# EAGLE schematic LCD-OLINUXINO-7TS_Rev_D (EAGLE 4.16)
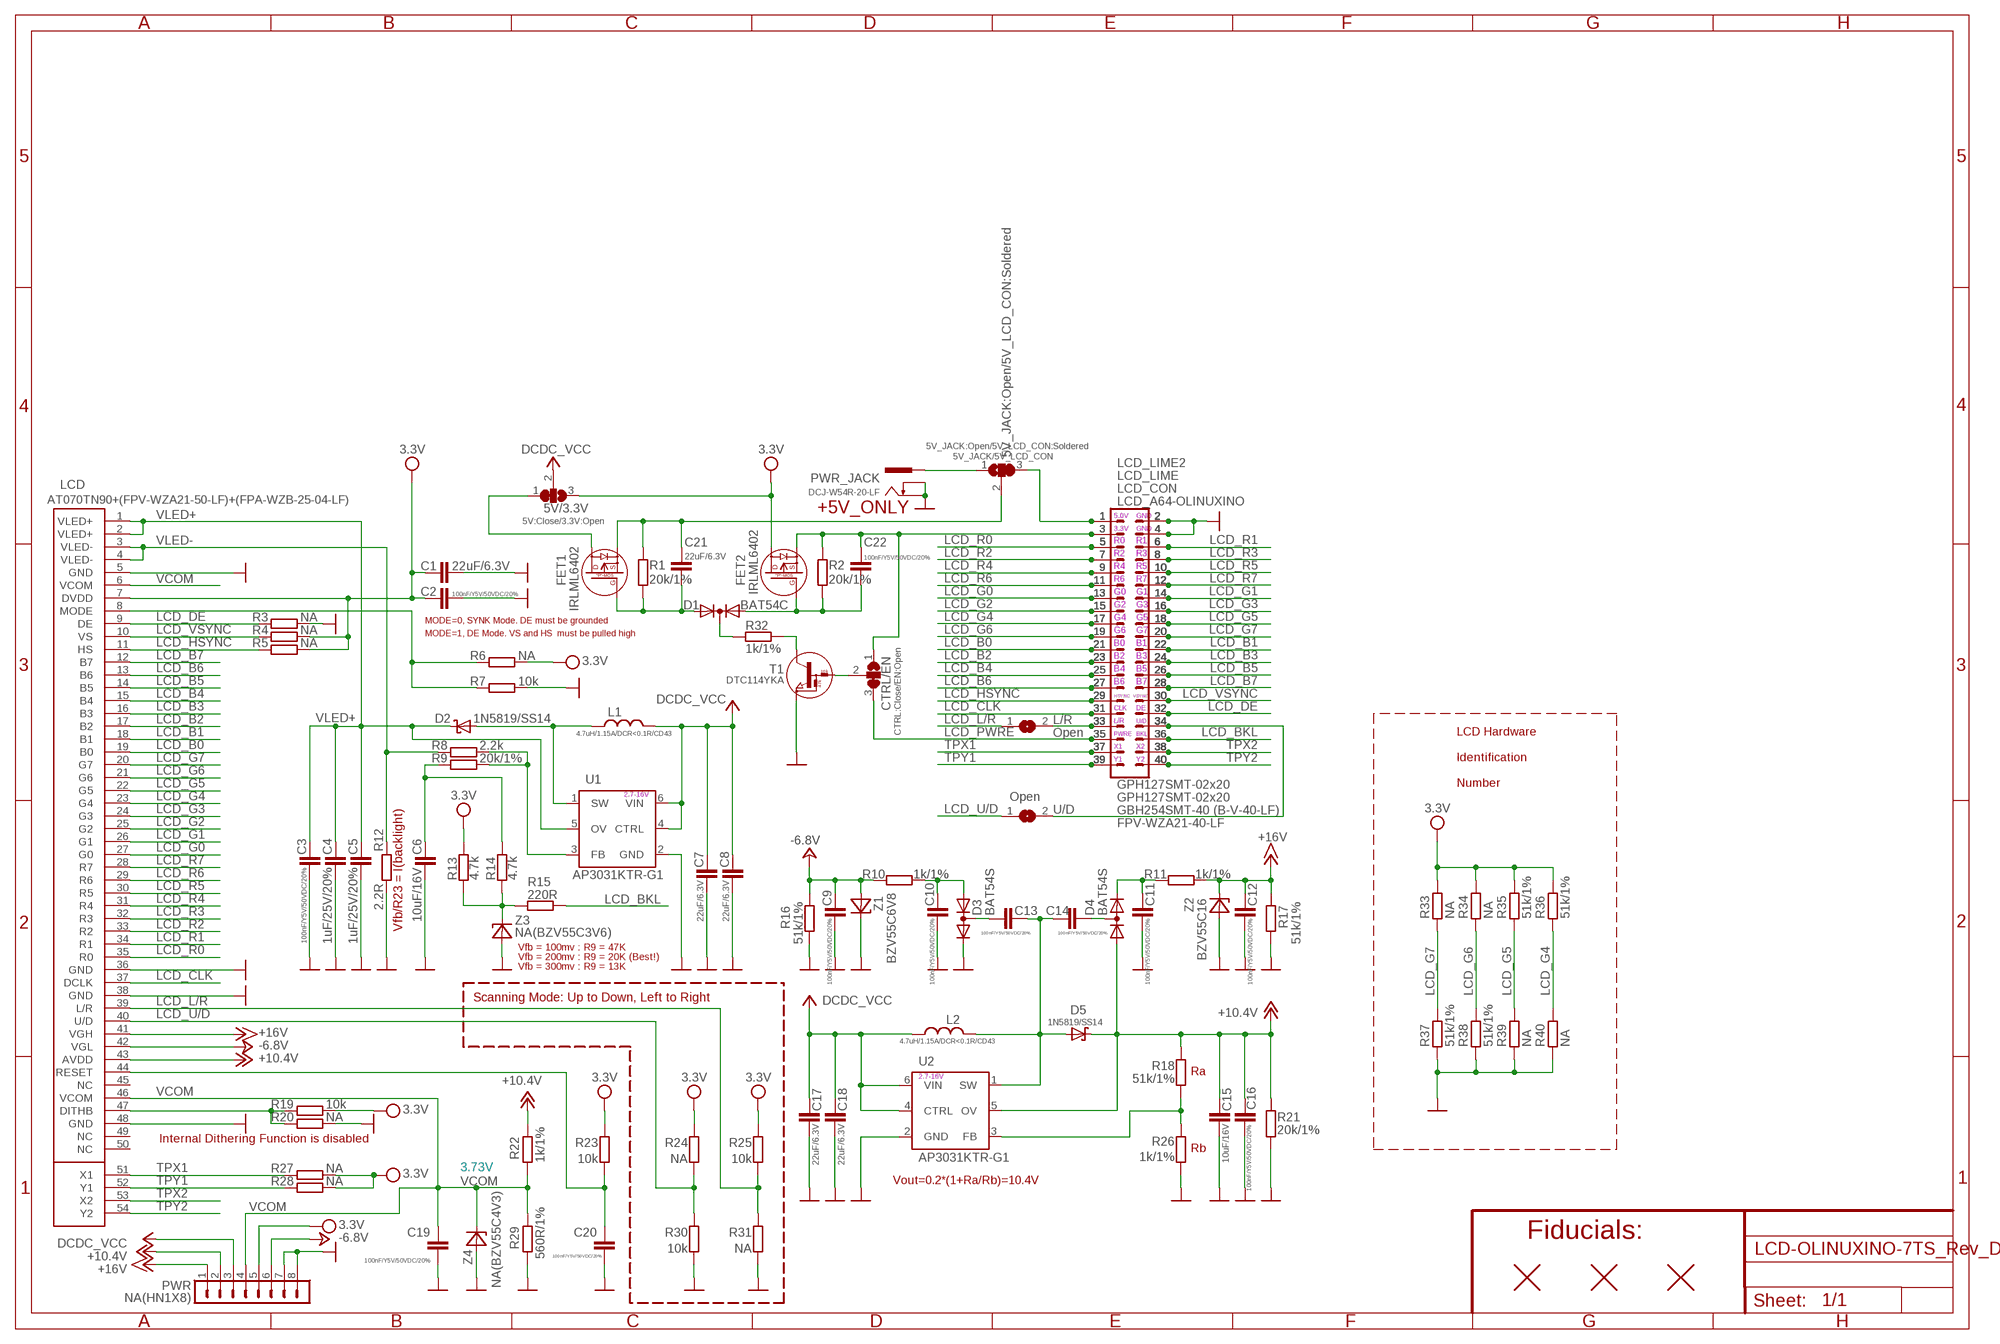
[diagram p0: schematic, sheet 1]

## Parts
5V/3.3V  5V:Close/3.3V:Open  SJ2W6  [SJ_2_SMALL_12_TIED]
5V_JACK/5V_LCD_CON  5V_JACK:Open/5V_LCD_CON:Soldered  SJ2W3  [SJ_2_SMALL]
C1  22uF/6.3V  C-EUC0603_DWS  [C0603_DWS]
C2  100nF/Y5V/50VDC/20%  C-EUC0603_DWS  [C0603_DWS]
C3  100nF/Y5V/50VDC/20%  C-EUC0603_DWS  [C0603_DWS]
C4  1uF/25V/20%  C-EUC0805_5MIL_DWS  [C0805_5MIL_DWS]
C5  1uF/25V/20%  C-EUC0805_5MIL_DWS  [C0805_5MIL_DWS]
C6  10uF/16V  C-EUC0805_5MIL_DWS  [C0805_5MIL_DWS]
C7  22uF/6.3V  C-EUC0603_DWS  [C0603_DWS]
C8  22uF/6.3V  C-EUC0603_DWS  [C0603_DWS]
C9  100nF/Y5V/50VDC/20%  C-EUC0603_DWS  [C0603_DWS]
C10  100nF/Y5V/50VDC/20%  C-EUC0603_DWS  [C0603_DWS]
C11  100nF/Y5V/50VDC/20%  C-EUC0603_DWS  [C0603_DWS]
C12  100nF/Y5V/50VDC/20%  C-EUC0603_DWS  [C0603_DWS]
C13  100nF/Y5V/50VDC/20%  C-EUC0603_DWS  [C0603_DWS]
C14  100nF/Y5V/50VDC/20%  C-EUC0603_DWS  [C0603_DWS]
C15  10uF/16V  C-EUC0805_5MIL_DWS  [C0805_5MIL_DWS]
C16  100nF/Y5V/50VDC/20%  C-EUC0603_DWS  [C0603_DWS]
C17  22uF/6.3V  C-EUC0603_DWS  [C0603_DWS]
C18  22uF/6.3V  C-EUC0603_DWS  [C0603_DWS]
C19  100nF/Y5V/50VDC/20%  C-EUC0603_DWS  [C0603_DWS]
C20  100nF/Y5V/50VDC/20%  C-EUC0603_DWS  [C0603_DWS]
C21  22uF/6.3V  C-EUC0603_DWS  [C0603_DWS]
C22  100nF/Y5V/50VDC/20%  C-EUC0603_DWS  [C0603_DWS]
CTRL/EN  CTRL:Close/EN:Open  SJ2W5  [SJ_2_SMALL_23_TIED]
D1  BAT54C  DIODE_AC-CA_  [SOT23C]
D2  1N5819/SS14  SCHOTKKY7.62SS2  [MLL-41]
D3  BAT54S  DIODE_AC-AC_  [SOT23C(BAT54S)]
D4  BAT54S  DIODE_AC-AC_  [SOT23C(BAT54S)]
D5  1N5819/SS14  SCHOTKKY7.62SS2  [MLL-41]
FET1  IRLML6402  P-MOS+DIODIRLML6402  [SOT23]
FET2  IRLML6402  P-MOS+DIODIRLML6402  [SOT23]
L1  4.7uH/1.15A/DCR<0.1R/CD43  L-CD42(43)  [CD42(43)]
L2  4.7uH/1.15A/DCR<0.1R/CD43  L-CD42(43)  [CD42(43)]
L/R  Open  SJSJ_SMALLER  [SJ_1_SMALLER]
LCD  AT070TN90+(FPV-WZA21-50-LF)+(FPA-WZB-25-04-LF)  LCD7"_TOUCH  [LCD7"_TOUCH(AT070TN90)]
LCD_A64-OLINUXINO  FPV-WZA21-40-LF  ML40-FPV-WZA21-40-LF  [FPV-WZA21-40-LF]
LCD_CON  GBH254SMT-40 (B-V-40-LF)  ML40-GBH-254-SMT-40_TEST  [ML40-MALE(GBH-254-SMT-40)_TEST]
LCD_LIME  GPH127SMT-02x20  ML40YA-V36P-2X20-LF_0.90_DRILL  [YA-V36P-2X20-LF_0.9DRILL]
LCD_LIME2  GPH127SMT-02x20  ML40PA-V16X-2X20-LF_0.90_DRILL  [GPH127SMT-02X20(PA-V16X-2X20-LF)_DRILL_0.9MM]
PWR  NA(HN1X8)  CON8HN1X8  [HN1X8]
PWR_JACK  DCJ-W54R-20-LF  PWR-JAKDCJ-W  [PWR-JACK-SMD]
R1  20k/1%  R-EU_R0603_5MIL_DWS  [R0603_5MIL_DWS]
R2  20k/1%  R-EU_R0603_5MIL_DWS  [R0603_5MIL_DWS]
R3  NA  R-EU_R0603_5MIL_DWS  [R0603_5MIL_DWS]
R4  NA  R-EU_R0603_5MIL_DWS  [R0603_5MIL_DWS]
R5  NA  R-EU_R0603_5MIL_DWS  [R0603_5MIL_DWS]
R6  NA  R-EU_R0603_5MIL_DWS  [R0603_5MIL_DWS]
R7  10k  R-EU_R0603_5MIL_DWS  [R0603_5MIL_DWS]
R8  2.2k  R-EU_R0603_5MIL_DWS  [R0603_5MIL_DWS]
R9  20k/1%  R-EU_R0603_5MIL_DWS  [R0603_5MIL_DWS]
R10  1k/1%  R-EU_R0603_5MIL_DWS  [R0603_5MIL_DWS]
R11  1k/1%  R-EU_R0603_5MIL_DWS  [R0603_5MIL_DWS]
R12  2.2R  R-EU_R0603_5MIL_DWS  [R0603_5MIL_DWS]
R13  4.7k  R-EU_R0603_5MIL_DWS  [R0603_5MIL_DWS]
R14  4.7k  R-EU_R0603_5MIL_DWS  [R0603_5MIL_DWS]
R15  220R  R-EU_R0603_5MIL_DWS  [R0603_5MIL_DWS]
R16  51k/1%  R-EU_R0603_5MIL_DWS  [R0603_5MIL_DWS]
R17  51k/1%  R-EU_R0603_5MIL_DWS  [R0603_5MIL_DWS]
R18  51k/1%  R-EU_R0603_5MIL_DWS  [R0603_5MIL_DWS]
R19  10k  R-EU_R0603_5MIL_DWS  [R0603_5MIL_DWS]
R20  NA  R-EU_R0603_5MIL_DWS  [R0603_5MIL_DWS]
R21  20k/1%  R-EU_R0603_5MIL_DWS  [R0603_5MIL_DWS]
R22  1k/1%  R-EU_R0603_5MIL_DWS  [R0603_5MIL_DWS]
R23  10k  R-EU_R0603_5MIL_DWS  [R0603_5MIL_DWS]
R24  NA  R-EU_R0603_5MIL_DWS  [R0603_5MIL_DWS]
R25  10k  R-EU_R0603_5MIL_DWS  [R0603_5MIL_DWS]
R26  1k/1%  R-EU_R0603_5MIL_DWS  [R0603_5MIL_DWS]
R27  NA  R-EU_R0603_5MIL_DWS  [R0603_5MIL_DWS]
R28  NA  R-EU_R0603_5MIL_DWS  [R0603_5MIL_DWS]
R29  560R/1%  R-EU_R0603_5MIL_DWS  [R0603_5MIL_DWS]
R30  10k  R-EU_R0603_5MIL_DWS  [R0603_5MIL_DWS]
R31  NA  R-EU_R0603_5MIL_DWS  [R0603_5MIL_DWS]
R32  1k/1%  R-EU_R0603_5MIL_DWS  [R0603_5MIL_DWS]
R33  NA  R-EU_R0603_5MIL_DWS  [R0603_5MIL_DWS]
R34  NA  R-EU_R0603_5MIL_DWS  [R0603_5MIL_DWS]
R35  51k/1%  R-EU_R0603_5MIL_DWS  [R0603_5MIL_DWS]
R36  51k/1%  R-EU_R0603_5MIL_DWS  [R0603_5MIL_DWS]
R37  51k/1%  R-EU_R0603_5MIL_DWS  [R0603_5MIL_DWS]
R38  51k/1%  R-EU_R0603_5MIL_DWS  [R0603_5MIL_DWS]
R39  NA  R-EU_R0603_5MIL_DWS  [R0603_5MIL_DWS]
R40  NA  R-EU_R0603_5MIL_DWS  [R0603_5MIL_DWS]
T1  DTC114YKA  DIGITAL_TRANSISTORS-NPNDTC114YKA  [SOT-23]
U1  AP3031KTR-G1  [SOT23-6]
U2  AP3031KTR-G1  [SOT23-6]
U$1  FIDUCIAL  [FIDUCIAL-1X3]
U$2  FIDUCIAL  [FIDUCIAL-1X3]
U$3  FIDUCIAL  [FIDUCIAL-1X3]
U/D  Open  SJSJ_SMALLER  [SJ_1_SMALLER]
Z1  BZV55C6V8  ZDIOD-SMD  [MINI-MELF]
Z2  BZV55C16  ZDIOD-SMD  [MINI-MELF]
Z3  NA(BZV55C3V6)  ZDIOD-SMD  [MINI-MELF]
Z4  NA(BZV55C4V3)  ZDIOD-SMD  [MINI-MELF]

## Nets
+5V: 5V/3.3V.2 C7.2 C8.2 C17.2 C18.2 L1.1 L2.1 PWR.3 U1.4(CTRL) U1.6(VIN) U2.4(CTRL) U2.6(VIN) ; supply symbol labelled DCDC_VCC
+12V: C15.1 C16.1 D4.1(A) D5.K(C) LCD.43(AVDD) PWR.2 R18.2 R21.2 R22.1 U2.5(OV) ; supply symbol labelled +10.4V
+15V: C12.1 LCD.41(VGH) PWR.1 R11.1 R17.2 Z2.1(C) ; supply symbol labelled +16V
-24V: C9.1 LCD.42(VGL) PWR.6 R10.1 R16.2 Z1.2(A) ; supply symbol labelled -6.8V
GND [pwr]: C1.2 C2.2 C3.2 C4.2 C5.2 C6.2 C7.1 C8.1 C9.2 C10.2 C11.2 C12.2 C15.2 C16.2 C17.1 C18.1 C19.2 C20.2 D3.2(K) LCD.5(GND) LCD.36(GND) LCD.38(GND) LCD.48(GND) LCD_A64-OLINUXINO.2 LCD_A64-OLINUXINO.4 LCD_CON.2 LCD_CON.4 LCD_LIME2.2 LCD_LIME2.4 LCD_LIME.2 LCD_LIME.4 PWR.7 PWR.8 PWR_JACK.2(-) PWR_JACK.3(--) R3.1 R7.1 R12.2 R16.1 R17.1 R20.1 R21.1 R26.2 R29.2 R30.2 R31.2 R37.1 R38.1 R39.1 R40.1 T1.2(E) U1.2(GND) U2.2(GND) Z1.1(C) Z2.2(A) Z3.2(A) Z4.2(A)
LCD_B0: LCD.19(B0) LCD_A64-OLINUXINO.21 LCD_CON.21 LCD_LIME2.21 LCD_LIME.21
LCD_B1: LCD.18(B1) LCD_A64-OLINUXINO.22 LCD_CON.22 LCD_LIME2.22 LCD_LIME.22
LCD_B2: LCD.17(B2) LCD_A64-OLINUXINO.23 LCD_CON.23 LCD_LIME2.23 LCD_LIME.23
LCD_B3: LCD.16(B3) LCD_A64-OLINUXINO.24 LCD_CON.24 LCD_LIME2.24 LCD_LIME.24
LCD_B4: LCD.15(B4) LCD_A64-OLINUXINO.25 LCD_CON.25 LCD_LIME2.25 LCD_LIME.25
LCD_B5: LCD.14(B5) LCD_A64-OLINUXINO.26 LCD_CON.26 LCD_LIME2.26 LCD_LIME.26
LCD_B6: LCD.13(B6) LCD_A64-OLINUXINO.27 LCD_CON.27 LCD_LIME2.27 LCD_LIME.27
LCD_B7: LCD.12(B7) LCD_A64-OLINUXINO.28 LCD_CON.28 LCD_LIME2.28 LCD_LIME.28
LCD_BKL: LCD_A64-OLINUXINO.36 LCD_CON.36 LCD_LIME2.36 LCD_LIME.36 R15.1
LCD_CLK: LCD.37(DCLK) LCD_A64-OLINUXINO.31 LCD_CON.31 LCD_LIME2.31 LCD_LIME.31
LCD_DE: LCD.9(DE) LCD_A64-OLINUXINO.32 LCD_CON.32 LCD_LIME2.32 LCD_LIME.32 R3.2
LCD_G0: LCD.27(G0) LCD_A64-OLINUXINO.13 LCD_CON.13 LCD_LIME2.13 LCD_LIME.13
LCD_G1: LCD.26(G1) LCD_A64-OLINUXINO.14 LCD_CON.14 LCD_LIME2.14 LCD_LIME.14
LCD_G2: LCD.25(G2) LCD_A64-OLINUXINO.15 LCD_CON.15 LCD_LIME2.15 LCD_LIME.15
LCD_G3: LCD.24(G3) LCD_A64-OLINUXINO.16 LCD_CON.16 LCD_LIME2.16 LCD_LIME.16
LCD_G4: LCD.23(G4) LCD_A64-OLINUXINO.17 LCD_CON.17 LCD_LIME2.17 LCD_LIME.17 R36.1 R40.2
LCD_G5: LCD.22(G5) LCD_A64-OLINUXINO.18 LCD_CON.18 LCD_LIME2.18 LCD_LIME.18 R35.1 R39.2
LCD_G6: LCD.21(G6) LCD_A64-OLINUXINO.19 LCD_CON.19 LCD_LIME2.19 LCD_LIME.19 R34.1 R38.2
LCD_G7: LCD.20(G7) LCD_A64-OLINUXINO.20 LCD_CON.20 LCD_LIME2.20 LCD_LIME.20 R33.1 R37.2
LCD_HSYNC: LCD.11(HS) LCD_A64-OLINUXINO.29 LCD_CON.29 LCD_LIME2.29 LCD_LIME.29 R5.2
LCD_L/R: L/R.1 LCD.39(L/R) R25.2 R31.1
LCD_PWRE: CTRL/EN.3 LCD_A64-OLINUXINO.35 LCD_CON.35 LCD_LIME2.35 LCD_LIME.35
LCD_R0: LCD.35(R0) LCD_A64-OLINUXINO.5 LCD_CON.5 LCD_LIME2.5 LCD_LIME.5
LCD_R1: LCD.34(R1) LCD_A64-OLINUXINO.6 LCD_CON.6 LCD_LIME2.6 LCD_LIME.6
LCD_R2: LCD.33(R2) LCD_A64-OLINUXINO.7 LCD_CON.7 LCD_LIME2.7 LCD_LIME.7
LCD_R3: LCD.32(R3) LCD_A64-OLINUXINO.8 LCD_CON.8 LCD_LIME2.8 LCD_LIME.8
LCD_R4: LCD.31(R4) LCD_A64-OLINUXINO.9 LCD_CON.9 LCD_LIME2.9 LCD_LIME.9
LCD_R5: LCD.30(R5) LCD_A64-OLINUXINO.10 LCD_CON.10 LCD_LIME2.10 LCD_LIME.10
LCD_R6: LCD.29(R6) LCD_A64-OLINUXINO.11 LCD_CON.11 LCD_LIME2.11 LCD_LIME.11
LCD_R7: LCD.28(R7) LCD_A64-OLINUXINO.12 LCD_CON.12 LCD_LIME2.12 LCD_LIME.12
LCD_U/D: LCD.40(U/D) R24.2 R30.1 U/D.1
LCD_VSYNC: LCD.10(VS) LCD_A64-OLINUXINO.30 LCD_CON.30 LCD_LIME2.30 LCD_LIME.30 R4.2
N$1: LCD.8(MODE) R6.2 R7.2
N$2: C14.2 D4.3(AK)
N$3 [pwr]: C22.1 CTRL/EN.1 FET2.2(S) LCD_A64-OLINUXINO.3 LCD_CON.3 LCD_LIME2.3 LCD_LIME.3 R2.2
N$4: C11.1 D4.2(K) R11.2
N$5: R8.1 R9.1 U1.3(FB)
N$6: C10.1 D3.1(A) R10.2
N$7: 5V_JACK/5V_LCD_CON.2 C21.1 FET1.2(S) R1.2
N$8: C22.2 D1.1(A1) FET2.1(G) R2.1
N$9: C21.2 D1.2(A2) FET1.1(G) R1.1
N$10: C13.1 D3.3(AK)
N$11: R32.1 T1.3(C)
N$12: C6.1 R9.2 R14.2
N$13: D2.A L1.2 U1.1(SW)
N$14: R13.1 R14.1 R15.2 Z3.1(C)
N$15: L/R.2 LCD_A64-OLINUXINO.33 LCD_CON.33 LCD_LIME2.33 LCD_LIME.33
N$16: CTRL/EN.2 T1.1(B)
N$17: LCD_A64-OLINUXINO.34 LCD_CON.34 LCD_LIME2.34 LCD_LIME.34 U/D.2
N$18: 5V/3.3V.1 FET1.3(D)
N$19: D1.3(K) R32.2
N$22: 5V_JACK/5V_LCD_CON.1 PWR_JACK.1(+)
N$23: 5V_JACK/5V_LCD_CON.3 LCD_A64-OLINUXINO.1 LCD_CON.1 LCD_LIME2.1 LCD_LIME.1
N$42: LCD.47(DITHB) R19.2 R20.2
N$123: C13.2 C14.1 D5.A L2.2 U2.1(SW)
N$126: R18.1 R26.1 U2.3(FB)
RESET: C20.1 LCD.44(RESET) R23.2
TPX1: LCD.51(X1) LCD_A64-OLINUXINO.37 LCD_CON.37 LCD_LIME2.37 LCD_LIME.37 R27.2
TPX2: LCD.53(X2) LCD_A64-OLINUXINO.38 LCD_CON.38 LCD_LIME2.38 LCD_LIME.38
TPY1: LCD.52(Y1) LCD_A64-OLINUXINO.39 LCD_CON.39 LCD_LIME2.39 LCD_LIME.39 R28.2
TPY2: LCD.54(Y2) LCD_A64-OLINUXINO.40 LCD_CON.40 LCD_LIME2.40 LCD_LIME.40
VCC [pwr]: 5V/3.3V.3 C1.1 C2.1 FET2.3(D) LCD.7(DVDD) PWR.5 R4.1 R5.1 R6.1 R13.2 R19.1 R23.1 R24.1 R25.1 R27.1 R28.1 R33.2 R34.2 R35.2 R36.2 ; supply symbol labelled 3.3V
VCOM: C19.1 LCD.6(VCOM) LCD.46(VCOM) PWR.4 R22.2 R29.1 Z4.1(C)
VLED+: C3.1 C4.1 C5.1 D2.K(C) LCD.1(VLED+) LCD.2(VLED+) U1.5(OV)
VLED-: LCD.3(VLED-) LCD.4(VLED-) R8.2 R12.1
Unconnected: LCD.45(NC) LCD.49(NC) LCD.50(NC)

## Notes on the sheet
- 5V_JACK:Open/5V_LCD_CON:Soldered
- +5V_ONLY
- 5.0V | GND
- 3.3V | GND
- R0 | R1
- R2 | R3
- R4 | R5
- R6 | R7
- G0 | G1
- G2 | G3
- G4 | G5
- MODE=0, SYNK Mode. DE must be grounded
- G6 | G7
- MODE=1, DE Mode. VS and HS  must be pulled high
- B0 | B1
- B2 | B3
- B4 | B5
- B6 | B7
- HSYNC | VSYNC
- CLK | DE
- L/R | U/D
- PWRE | BKL | LCD Hardware
- X1 | X2
- Y1 | Y2 | Identification
- Number
- 2.7-16V
- Vfb/R23 = I(backlight)
- Vfb = 100mv : R9 = 47K
- Vfb = 200mv : R9 = 20K (Best!)
- Vfb = 300mv : R9 = 13K
- Scanning Mode: Up to Down, Left to Right
- Ra
- 2.7-16V
- Internal Dithering Function is disabled
- Rb
- 3.73V
- Vout=0.2*(1+Ra/Rb)=10.4V
- Fiducials:

## Library data of the parts
5V/3.3V 5V_JACK/5V_LCD_CON CTRL/EN = jumper:SJ2W: SMD solder JUMPER
C1-C22 = rcl:C-EU: CAPACITOR, European symbol
D1 = semicon-smd-ipc:DIODE_AC-CA_: DUAL DIODE
D2 D5 = gogo:SCHOTKKY7.62SS
D3 D4 = semicon-smd-ipc:DIODE_AC-AC_: DUAL DIODE
FET1 FET2 = Penko:P-MOS+DIOD
L1 L2 = OLIMEX_DISCRET:L
L/R U/D = jumper:SJ: SMD solder JUMPER
LCD = olimex_lcd:LCD7"_TOUCH
LCD_A64-OLINUXINO LCD_CON LCD_LIME LCD_LIME2 = con-harting-ml:ML40: HARTING
PWR = Penko:CON8
PWR_JACK = gogo:PWR-JAK
R1-R40 = rcl:R-EU_: RESISTOR, European symbol
T1 = OLIMEX_DISCRET:DIGITAL_TRANSISTORS-NPN: DTC114YKA Digital Transistor - NPN
U1 U2 = OLIMEX_IC:AP3031
U$1-U$3 = SparkFunEagle-6-6-07:FIDUCIAL: Fiducial Alignment Points Various fiducial points for machine vision alignment.
Z1-Z4 = gogo:ZDIOD-SMD

## Net classes
1 pwr: width 0.203 mm, drill 0.203 mm, clearance 0.203 mm